# Altium project 002-H-01 SLS to CAN.PrjPcb
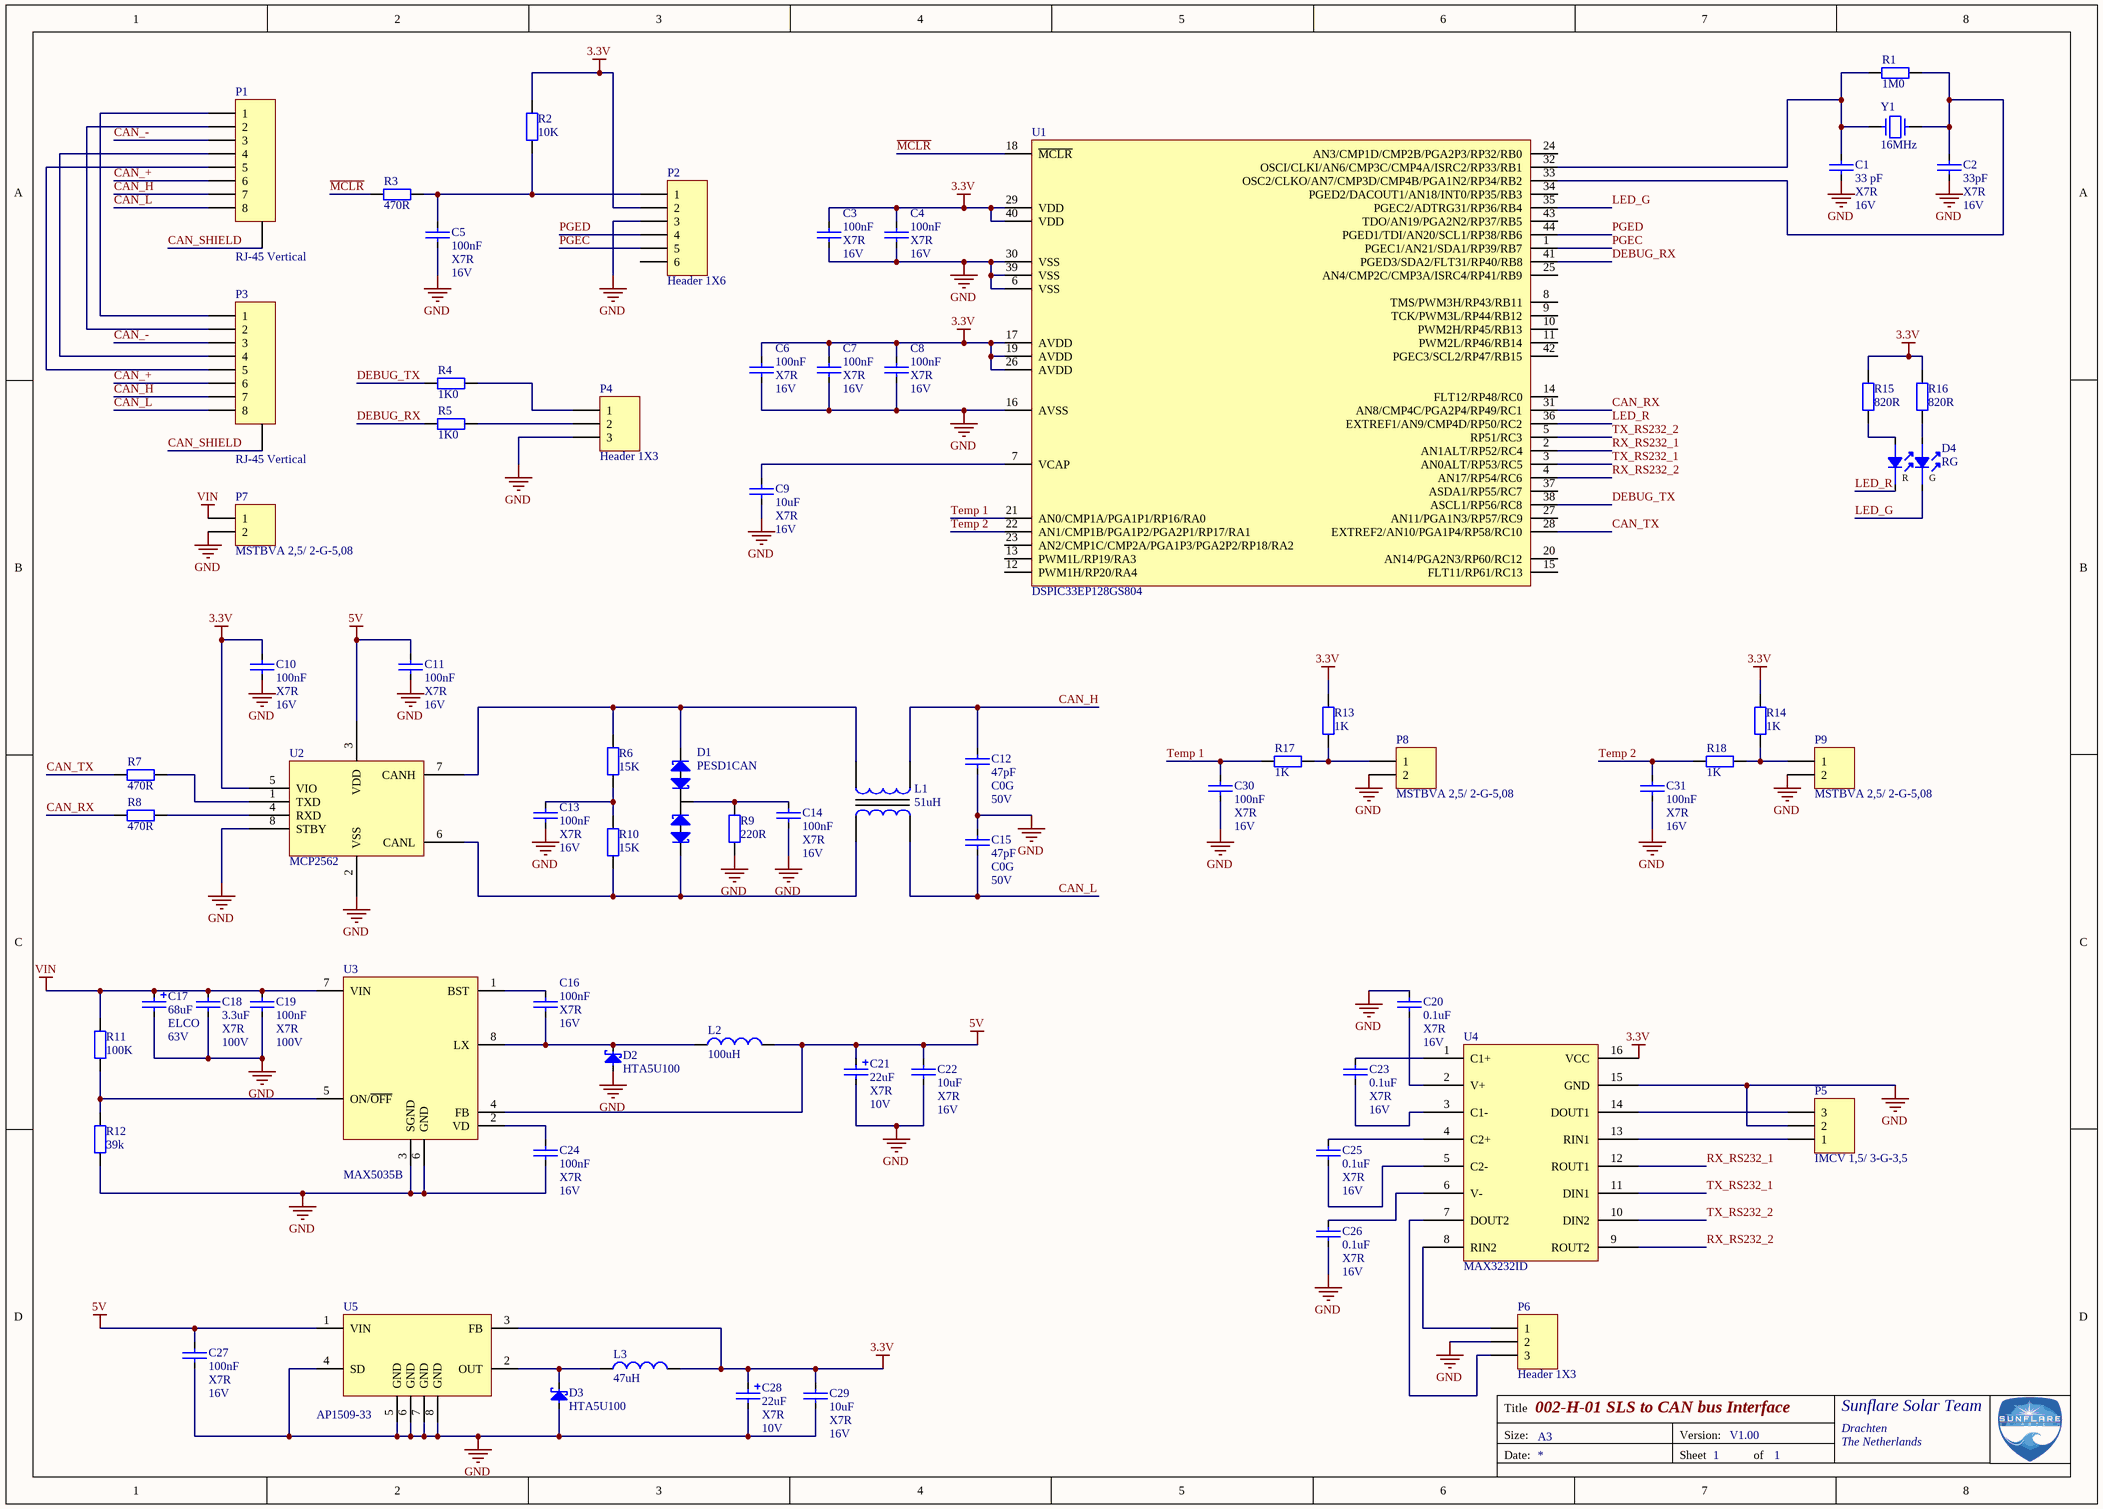
[diagram p0: 002-H-01 SLS to CAN.SchDoc]
1 sheet, 71 parts. Net scope: global (net labels, ports and power ports of the same name join across sheets).
Board file: 002-H-01 SLS to CAN.PcbDoc

## Sheet 002-H-01 SLS to CAN.SchDoc: 002-H-01 SLS to CAN bus Interface
size A3; Organization: Sunflare Solar Team; Address1: Drachten; Address2: The Netherlands; Revision: V1.00; SheetNumber: 1; SheetTotal: 1

### Parts
C1  33 pF  Dielectric: X7R  VoltageRating: 16V  [CAP0805]
C2  33pF  Dielectric: X7R  VoltageRating: 16V  [CAP0805]
C3  100nF  Dielectric: X7R  VoltageRating: 16V  [CAP0805]
C4  100nF  Dielectric: X7R  VoltageRating: 16V  [CAP0805]
C5  100nF  Dielectric: X7R  VoltageRating: 16V  [CAP0805]
C6  100nF  Dielectric: X7R  VoltageRating: 16V  [CAP0805]
C7  100nF  Dielectric: X7R  VoltageRating: 16V  [CAP0805]
C8  100nF  Dielectric: X7R  VoltageRating: 16V  [CAP0805]
C9  10uF  Dielectric: X7R  VoltageRating: 16V  [CAP1210]
C10  100nF  Dielectric: X7R  VoltageRating: 16V  [CAP0805]
C11  100nF  Dielectric: X7R  VoltageRating: 16V  [CAP0805]
C12  47pF  Dielectric: C0G  VoltageRating: 50V  [CAP0805]
C13  100nF  Dielectric: X7R  VoltageRating: 16V  [CAP0805]
C14  100nF  Dielectric: X7R  VoltageRating: 16V  [CAP0805]
C15  47pF  Dielectric: C0G  VoltageRating: 50V  [CAP0805]
C16  100nF  Dielectric: X7R  VoltageRating: 16V  [CAP0805]
C17  68uF  Dielectric: ELCO  VoltageRating: 63V  [CAPP8383X62N]
C18  3.3uF  Dielectric: X7R  VoltageRating: 100V  [CAP1210]
C19  100nF  Dielectric: X7R  VoltageRating: 100V  [CAP0805]
C20  0.1uF  Dielectric: X7R  VoltageRating: 16V  [CAP0805]
C21  22uF  Dielectric: X7R  VoltageRating: 10V  [CAPAE4243X55M]
C22  10uF  Dielectric: X7R  VoltageRating: 16V  [CAP1210]
C23  0.1uF  Dielectric: X7R  VoltageRating: 16V  [CAP0805]
C24  100nF  Dielectric: X7R  VoltageRating: 16V  [CAP0805]
C25  0.1uF  Dielectric: X7R  VoltageRating: 16V  [CAP0805]
C26  0.1uF  Dielectric: X7R  VoltageRating: 16V  [CAP0805]
C27  100nF  Dielectric: X7R  VoltageRating: 16V  [CAP0805]
C28  22uF  Dielectric: X7R  VoltageRating: 10V  [CAPAE4243X55M]
C29  10uF  Dielectric: X7R  VoltageRating: 16V  [CAP1210]
C30  100nF  Dielectric: X7R  VoltageRating: 16V  [CAP0805]
C31  100nF  Dielectric: X7R  VoltageRating: 16V  [CAP0805]
D1  PESD1CAN  [SOT23-3N]
D2  HTA5U100  [DIODEDO-214AC]
D3  HTA5U100  [DIODEDO-214AC]
D4  RG  [CAC-75P125X160-4N]
L1  51uH  [IND200P450X300-4N]
L2  100uH  [INDP3030X28N]
L3  47uH  [INDP3030X28N]
P1  RJ-45 Vertical  [Amphenol RJ-45 Vertical]
P2  Header 1X6  [Header1X6P100]
P3  RJ-45 Vertical  [Amphenol RJ-45 Vertical]
P4  Header 1X3  [Header1X3P100]
P5  IMCV 1,5/ 3-G-3,5  [Phoenix IMCV 1,5/ 3-G-3,81]
P6  Header 1X3  [Header1X3P100]
P7  MSTBVA 2,5/ 2-G-5,08  [MSTBVA 2,5/ 2-G-5,08]
P8  MSTBVA 2,5/ 2-G-5,08  [MSTBVA 2,5/ 2-G-5,08]
P9  MSTBVA 2,5/ 2-G-5,08  [MSTBVA 2,5/ 2-G-5,08]
R1  1M0  [RES0805]
R2  10K  [RES0805]
R3  470R  [RES0805]
R4  1K0  [RES0805]
R5  1K0  [RES0805]
R6  15K  [RES0805]
R7  470R  [RES0805]
R8  470R  [RES0805]
R9  220R  [RES0805]
R10  15K  [RES0805]
R11  100K  [RES0805]
R12  39k  [RES0805]
R13  1K  [RES0805]
R14  1K  [RES0805]
R15  820R  [RES0805]
R16  820R  [RES0805]
R17  1K  [RES0805]
R18  1K  [RES0805]
U1  DSPIC33EP128GS804  [TQFP80P1200X1200X120-44N]
U2  MCP2562  [SOIC-8N]
U3  MAX5035B  [SOIC-8N]
U4  MAX3232ID  [SOIC16_MAX3232]
U5  AP1509-33  [SOIC-8N]
Y1  16MHz  [XT49M-2016M]

### Nets
3.3V: C3.2 C4.2 C6.2 C7.2 C8.2 C10.2 C28.1 C29.2 L3.2 P2.2 R2.1 R13.2 R14.2 R15.1 R16.1 U1.17(AVDD) U1.19(AVDD) U1.26(AVDD) U1.29(VDD) U1.40(VDD) U2.5(VIO) U4.16(VCC) U5.3(FB)
5V: C11.2 C21.1 C22.2 C27.2 L2.2 U2.3(VDD) U3.4(FB) U5.1(VIN)
GND: C1.1 C2.1 C3.1 C4.1 C5.2 C6.1 C7.1 C8.1 C9.1 C10.1 C11.1 C12.1 C13.1 C14.1 C15.2 C17.2 C18.1 C19.1 C20.2 C21.2 C22.1 C24.1 C26.1 C27.1 C28.2 C29.1 C30.1 C31.1 D2.2(A) D3.2(A) P2.3 P4.3 P5.2 P6.2 P7.2 P8.2 P9.2 R9.2 R12.2 U1.6(VSS) U1.16(AVSS) U1.30(VSS) U1.39(VSS) U2.2(VSS) U2.8(STBY) U3.3(SGND) U3.6(GND) U4.15(GND) U5.4(SD) U5.5(GND) U5.6(GND) U5.7(GND) U5.8(GND)
VIN: C17.1 C18.2 C19.2 P7.1 R11.1 U3.7(VIN)
CAN_+: P1.6 P3.6
CAN_-: P1.3 P3.3
CAN_H: C12.2 L1.3 P1.7 P3.7
CAN_L: C15.1 L1.2 P1.8 P3.8
CAN_RX: R8.1 U1.31(AN8/CMP4C/PGA2P4/RP49/RC1)
CAN_SHIELD: P1.9(G) P3.9(G)
CAN_TX: R7.1 U1.28(EXTREF2/AN10/PGA1P4/RP58/RC10)
DEBUG_RX: R5.1 U1.41(PGED3/SDA2/FLT31/RP40/RB8)
DEBUG_TX: R4.1 U1.38(ASCL1/RP56/RC8)
LED_G: D4.4(K_G) U1.35(PGEC2/ADTRG31/RP36/RB4)
LED_R: D4.2(K_R) U1.36(EXTREF1/AN9/CMP4D/RP50/RC2)
~{MCLR}: R3.1 U1.18(~{MCLR})
PGEC: P2.5 U1.1(PGEC1/AN21/SDA1/RP39/RB7)
PGED: P2.4 U1.44(PGED1/TDI/AN20/SCL1/RP38/RB6)
RX_RS232_1: U1.2(AN1ALT/RP52/RC4) U4.12(ROUT1)
RX_RS232_2: U1.4(AN17/RP54/RC6) U4.9(ROUT2)
Temp 1: C30.2 R17.1 U1.21(AN0/CMP1A/PGA1P1/RP16/RA0)
Temp 2: C31.2 R18.1 U1.22(AN1/CMP1B/PGA1P2/PGA2P1/RP17/RA1)
TX_RS232_1: U1.3(AN0ALT/RP53/RC5) U4.11(DIN1)
TX_RS232_2: U1.5(RP51/RC3) U4.10(DIN2)
NetC1_2: C1.2 R1.1 U1.32(OSCI/CLKI/AN6/CMP3C/CMP4A/ISRC2/RP33/RB1) Y1.1
NetC2_2: C2.2 R1.2 U1.33(OSC2/CLKO/AN7/CMP3D/CMP4B/PGA1N2/RP34/RB2) Y1.2
NetC5_1: C5.1 P2.1 R2.2 R3.2
NetC9_2: C9.2 U1.7(VCAP)
NetC13_2: C13.2 R6.2 R10.1
NetC14_2: C14.2 D1.3 R9.1
NetC16_1: C16.1 D2.1(K) L2.1 U3.8(LX)
NetC16_2: C16.2 U3.1(BST)
NetC20_1: C20.1 U4.2(V+)
NetC23_1: C23.1 U4.3(C1-)
NetC23_2: C23.2 U4.1(C1+)
NetC24_2: C24.2 U3.2(VD)
NetC25_1: C25.1 U4.5(C2-)
NetC25_2: C25.2 U4.4(C2+)
NetC26_2: C26.2 U4.6(V-)
NetD1_1: D1.1 L1.4 R6.1 U2.7(CANH)
NetD1_2: D1.2 L1.1 R10.2 U2.6(CANL)
NetD3_1: D3.1(K) L3.1 U5.2(OUT)
NetD4_1: D4.1(A_R) R15.2
NetD4_3: D4.3(A_G) R16.2
NetP1_1: P1.1 P3.1
NetP1_2: P1.2 P3.2
NetP1_4: P1.4 P3.4
NetP1_5: P1.5 P3.5
NetP4_1: P4.1 R4.2
NetP4_2: P4.2 R5.2
NetP5_1: P5.1 U4.13(RIN1)
NetP5_3: P5.3 U4.14(DOUT1)
NetP6_1: P6.1 U4.8(RIN2)
NetP6_3: P6.3 U4.7(DOUT2)
NetP8_1: P8.1 R13.1 R17.2
NetP9_1: P9.1 R14.1 R18.2
NetR7_2: R7.2 U2.1(TXD)
NetR8_2: R8.2 U2.4(RXD)
NetR11_2: R11.2 R12.1 U3.5(ON/~{OFF})

Not connected (* = marked no-connect by the designer): P2 6; U1 8(TMS/PWM3H/RP43/RB11) 9(TCK/PWM3L/RP44/RB12) 10(PWM2H/RP45/RB13) 11(PWM2L/RP46/RB14) 12(PWM1H/RP20/RA4) 13(PWM1L/RP19/RA3) 14(FLT12/RP48/RC0) 15(FLT11/RP61/RC13) 20(AN14/PGA2N3/RP60/RC12) 23(AN2/CMP1C/CMP2A/PGA1P3/PGA2P2/RP18/RA2) 24(AN3/CMP1D/CMP2B/PGA2P3/RP32/RB0) 25(AN4/CMP2C/CMP3A/ISRC4/RP41/RB9) 27(AN11/PGA1N3/RP57/RC9) 34(PGED2/DACOUT1/AN18/INT0/RP35/RB3) 37(ASDA1/RP55/RC7) 42(PGEC3/SCL2/RP47/RB15) 43(TDO/AN19/PGA2N2/RP37/RB5)

### Notes on the sheet
- Title
- Size:
- Date:
- A3
- Version:
- Sheet
- of
- (in symbol Led_RG) R; G

### Library data of the parts
C1-C8 C10-C16 C19 C20 C23-C27 C30 C31 = Capacitor: Manufacturer: -; Manufacturer Part No: -; Farnell Ordercode: -; Price: 0.00
C9 C22 C29 = Capacitor: Manufacturer: TDK; Manufacturer Part No: C3225X7R1C106K200AB; Farnell Ordercode: 2112722; Price: 1.35
C17 = CapacitorPol: Capacitor Pol; Manufacturer: Panasonic; Manufacturer Part No: EEEFK1J680UP; Farnell Ordercode: 1850126; Price: 0.70
C18 = Capacitor: Manufacturer: AVX; Manufacturer Part No: 12101C335KAZ2A; Farnell Ordercode: 2507771; Price: 1.41
C21 C28 = CapacitorPol: Capacitor Pol; Manufacturer: PANASONIC; Manufacturer Part No: EEEHA1A220WR; Farnell Ordercode: 1973288; Price: 0.00
D1 = PESD1CAN: ESD Protection Device, TVS, 70 V, SOT-23, 3 Pins; Manufacturer: NXP; Manufacturer Part No: PESD1CAN; Farnell Ordercode: 1510703; Price: 0.13
D2 D3 = Diode Schottky: Manufacturer: Multicomp; Manufacturer Part No: HTA5U100; Farnell Ordercode: 2750942; Price: 0.46
D4 = Led_RG: Led RG; Manufacturer: KINGBRIGHT; Manufacturer Part No: KPTB-1612LVSURKCGKC; Farnell Ordercode: 2846591; Price: 0.00
L1 = Choke Common Mode: Manufacturer: Bourns; Manufacturer Part No: SRF4532-510Y; Farnell Ordercode: 2859108; Price: 0.47
L2 = Inductor: Manufacturer: BOURNS; Manufacturer Part No: SDR0302-101KL; Farnell Ordercode: 2212477; Price: 0.408
L3 = Inductor: Manufacturer: Bourns; Manufacturer Part No: SDR0302-470KL; Farnell Ordercode: 2328694; Price: 0.403
P1 P3 = RJ-45 Vertical: Manufacturer: Amphenol; Manufacturer Part No: RJHSE-3P80; Farnell Ordercode: 2709006; Price: 0.908
P2 = Header1X6: Connector 1X6; Manufacturer: -; Manufacturer Part No: -; Farnell Ordercode: -; Price: 0.00
P4 P6 = Header1X3: Connector 1X3; Manufacturer: -; Manufacturer Part No: -; Farnell Ordercode: -; Price: 0.00
P5 = Phoenix  IMCV 1,5/ 3-G-3,5: IMCV 1,5/ 3-G-3,5 1830728; Manufacturer: -; Manufacturer Part No: -; Farnell Ordercode: -; Price: 0.00
P7-P9 = Phoenix  MSTBVA 2,5/ 2-G-5,08_1: MSTBVA 2,5/ 2-G-5,08  1757242; Manufacturer: -; Manufacturer Part No: -; Farnell Ordercode: -; Price: 0.00
R1-R18 = Resistor: Tolerance: 1%; Manufacturer: -; Manufacturer Part No: -; Farnell Ordercode: -; Price: 0.00
U1 = DSPIC33EP128GS804: 16-Bit Digital Signal Controllers fo  r Digital Power Applications with   Interconnected High-Speed PWM, ADC, PGA and Comparators; Manufacturer: Microchip; Manufacturer Part No: DSPIC33EP128GS804-I/PT; Farnell Ordercode: 2706170; Price: 4.44
U2 = MCP2562: CAN Bus, Transceiver, CAN, LIN, 1, 1, 4.5 V, 5.5 V, SOIC; Manufacturer: Microchip; Manufacturer Part No: MCP2562-E/SN; Farnell Ordercode: 2362839; price: 0.79
U3 = MAX5035B: 5V 1A, 76V, High-Efficiency MAXPower Step-Down DC-DC Converter; Manufacturer: Maxim Integrated Products; Manufacturer Part No: MAX5035BUSA+T; Farnell Ordercode: 2799102; Price: 3.26
U4 = MAX3232: RS232 tot TTL converter; Manufacturer: TEXAS INSTRUMENTS; Manufacturer Part No: MAX3232ID; Farnell Ordercode: 1652282; Price: 1.69
U5 = AP1509-33: 150KHz, 2A PWM BUCK DC/DC CONVERTER; Manufacturer: Diodes Inc; Manufacturer Part No: AP1509-33SG-13; Farnell Ordercode: 1825322; Price: 0.75
Y1 = Crystal: Manufacturer: Multicomp; Manufacturer Part No: MCRSD16000F183000RR; Farnell Ordercode: 2395958; Price: 0.19